# Altium schematic sheet LTC4359_28V_5A.schdoc
size 209 x 297 mm
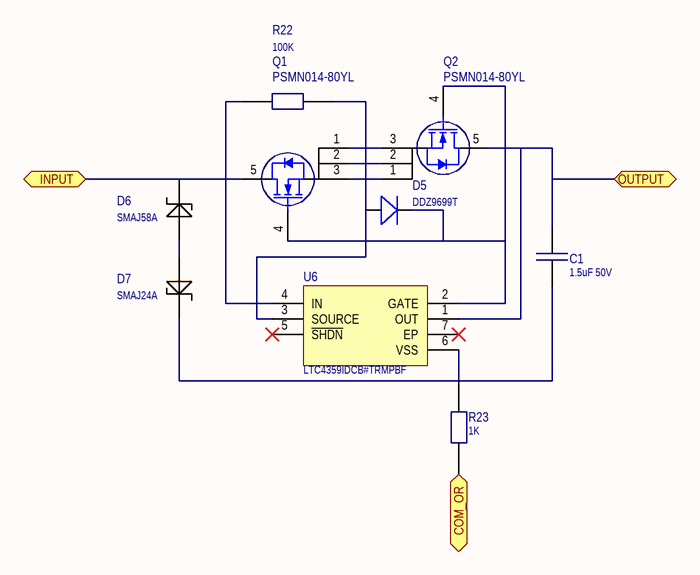
[diagram p0: LTC4359_28V_5A.schdoc]

## Parts
C1  1.5uF 50V  [C_0805]
D5  DDZ9699T  [SOD523F - 2]
D6  SMAJ58A  [DO-214AC]
D7  SMAJ24A  [DO-214AC]
Q1  PSMN014-80YL  [SOT669_LFPAK56; Power-SO8]
Q2  PSMN014-80YL  [SOT669_LFPAK56; Power-SO8]
R22  100K  [R_0603]
R23  1K  [R_0805]
U6  LTC4359IDCB#TRMPBF  [LT-DCB-6_V]

## Ports
COM_OR, INPUT, OUTPUT

## Nets
COM_OR: R23.1 ; port COM_OR
INPUT: D6.2(K) Q1.5(D) R22.1 U6.4(IN) ; port INPUT
OUTPUT: C1.2 Q2.5(D) U6.1(OUT) ; port OUTPUT
NetC1_1: C1.1 D7.2(K) R23.2 U6.6(VSS)
NetD5_1: D5.1(A) Q1.1(S) Q1.2(S) Q1.3(S) Q2.1(S) Q2.2(S) Q2.3(S) R22.2 U6.3(SOURCE)
NetD5_2: D5.2(K) Q1.4(G) Q2.4(G) U6.2(GATE)
NetD6_1: D6.1(A) D7.1(A)

Not connected (* = marked no-connect by the designer): U6 5(~{SHDN})* 7(EP)*

## Library data of the parts
C1 = C0805: Capacitor; Value: 1.5uF 50V
D5 = D_SOD523: Diode
D6 D7 = D_DO-214AC: Diode
Q1 Q2 = N-ch SOT669/LFPAK56: Power MOSFET
R22 = R0603: Resistor; Value: 100K
R23 = R0805: Resistor; Value: 1K
U6 = LTC4359IDCB#TRMPBF: ideal diode ic